# EAGLE design Simon (EAGLE 8.7.1)
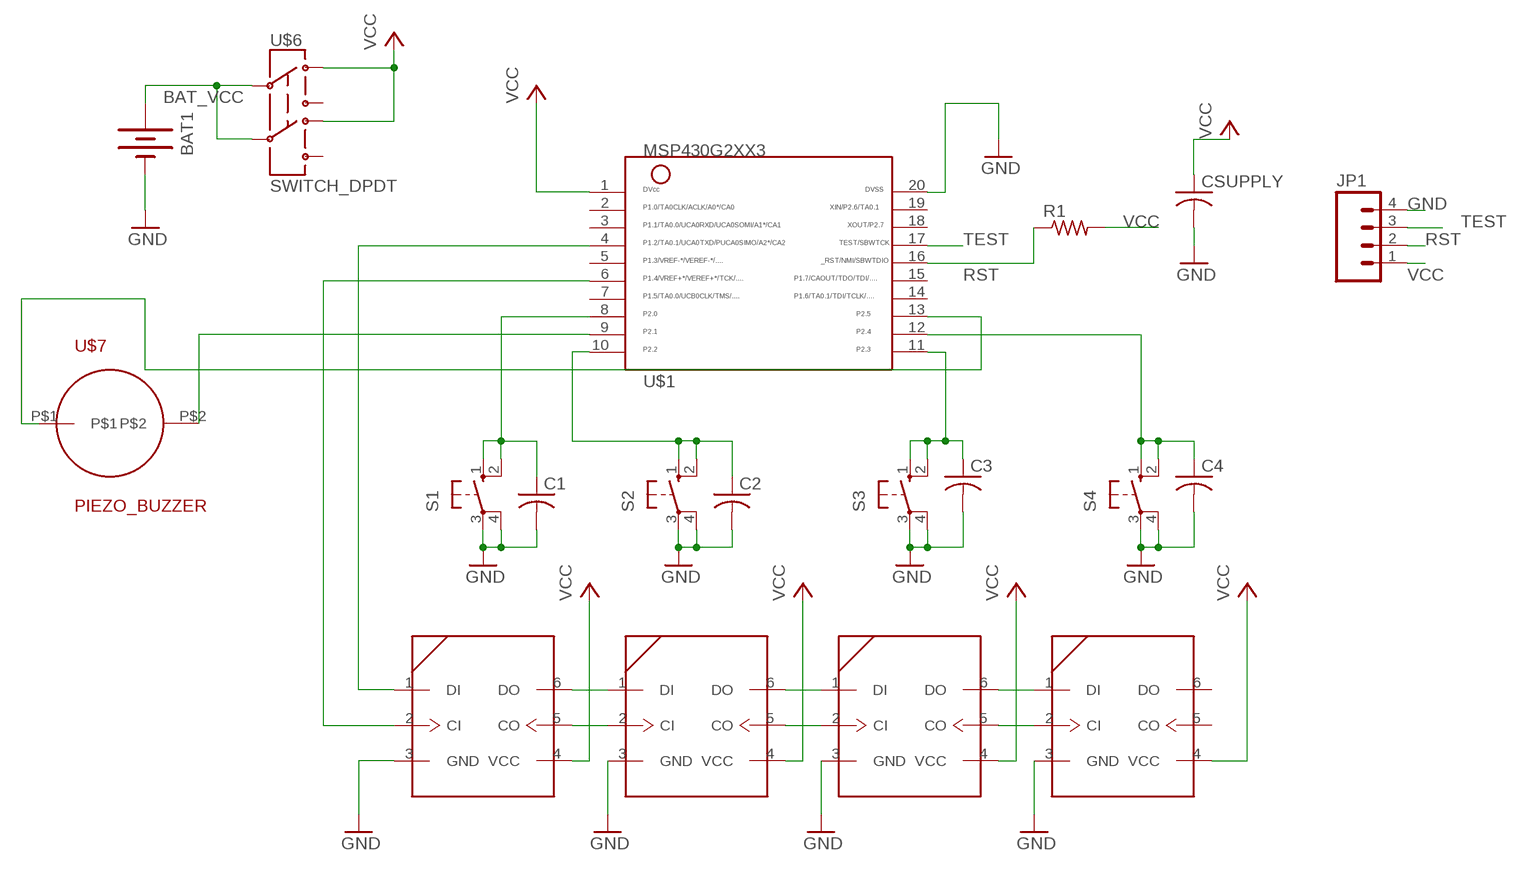
[diagram p0: schematic, sheet 1]

## Parts
BAT1  BATTERY  [BATTERY_PACK_2AA]
C1  C-USC1206  [C1206]
C2  C-USC1206  [C1206]
C3  C-USC1206  [C1206]
C4  C-USC1206  [C1206]
CSUPPLY  C-USC1206  [C1206]
JP1  M04LOCK  [1X04_LOCK]
LED1  APA102  [5050]
LED2  APA102  [5050]
LED3  APA102  [5050]
LED4  APA102  [5050]
R1  R-US_R1206  [R1206]
S1  10-XX  [B3F-10XX]
S2  10-XX  [B3F-10XX]
S3  10-XX  [B3F-10XX]
S4  10-XX  [B3F-10XX]
U$1  MSP430G2XX3TSSOP  [PW20]
U$6  SWITCH_DPDT  [JS_DPDT_TH]
U$7  PIEZO_BUZZER  [PIEZO_BUZZER]

## Nets
BAT_VCC: BAT1.3V(+) U$6.2 U$6.5
GND: BAT1.GND(-) C1.2 C2.2 C3.2 C4.2 CSUPPLY.2 JP1.4 LED1.3(GND) LED2.3(GND) LED3.3(GND) LED4.3(GND) S1.3(P) S1.4(P1) S2.3(P) S2.4(P1) S3.3(P) S3.4(P1) S4.3(P) S4.4(P1) U$1.20
N$1: LED1.6(DO) LED2.1(DI)
N$2: LED1.5(CO) LED2.2(CI)
N$3: LED2.6(DO) LED3.1(DI)
N$4: LED2.5(CO) LED3.2(CI)
N$5: LED3.6(DO) LED4.1(DI)
N$6: LED3.5(CO) LED4.2(CI)
N$7: LED1.1(DI) U$1.4
N$8: LED1.2(CI) U$1.6
N$10: U$1.9 U$7.P$2
N$11: U$1.13 U$7.P$1
N$13: C1.1 S1.1(S) S1.2(S1) U$1.8
N$14: C2.1 S2.1(S) S2.2(S1) U$1.10
N$15: C3.1 S3.1(S) S3.2(S1) U$1.11
N$16: C4.1 S4.1(S) S4.2(S1) U$1.12
RST: JP1.2 R1.1 U$1.16
TEST: JP1.3 U$1.17
VCC: CSUPPLY.1 JP1.1 LED1.4(VCC) LED2.4(VCC) LED3.4(VCC) LED4.4(VCC) R1.2 U$1.1 U$6.1 U$6.4
Unconnected: LED4.5(CO) LED4.6(DO) U$1.2 U$1.3 U$1.5 U$1.7 U$1.14 U$1.15 U$1.18 U$1.19 U$6.3 U$6.6

## Library data of the parts
BAT1 = ELEC327:BATTERY: Battery Holders Various common sizes : AA, AAA, 20mm coin cell and 12mm coin cell. 20MM_4LEGS, BATT-10373
C1-C4 CSUPPLY = rcl:C-US: CAPACITOR, American symbol
JP1 = SparkFun:M04: Header 4 Standard 4-pin 0.1" header. Use with straight break away headers (SKU : PRT-00116), right angle break away headers (PRT-00553), swiss pins (PRT-00743), machine pins (PRT-00117), and female headers (PRT-00115). Molex polarized connector foot print use with SKU : PRT-08231 with associated crimp pins and housings. 1MM SMD Version SKU: PRT-10208
LED1-LED4 = ELEC327:APA102: APA102 SPI RGB LED APA102 is a chainable RGB LED. The control protocol is a variant of SPI.
R1 = resistor:R-US_: RESISTOR, American symbol
S1-S4 = switch-omron:10-XX: OMRON SWITCH; MPN: B3F-1000; OC_FARNELL: 176432; OC_NEWARK: 36M3542
U$1 = ELEC327:MSP430G2XX3: MSP430G2XX3 PDIP (N) 20 Pin Package
U$6 = ELEC327:SWITCH_DPDT
U$7 = ELEC327:PIEZO_BUZZER

## Board
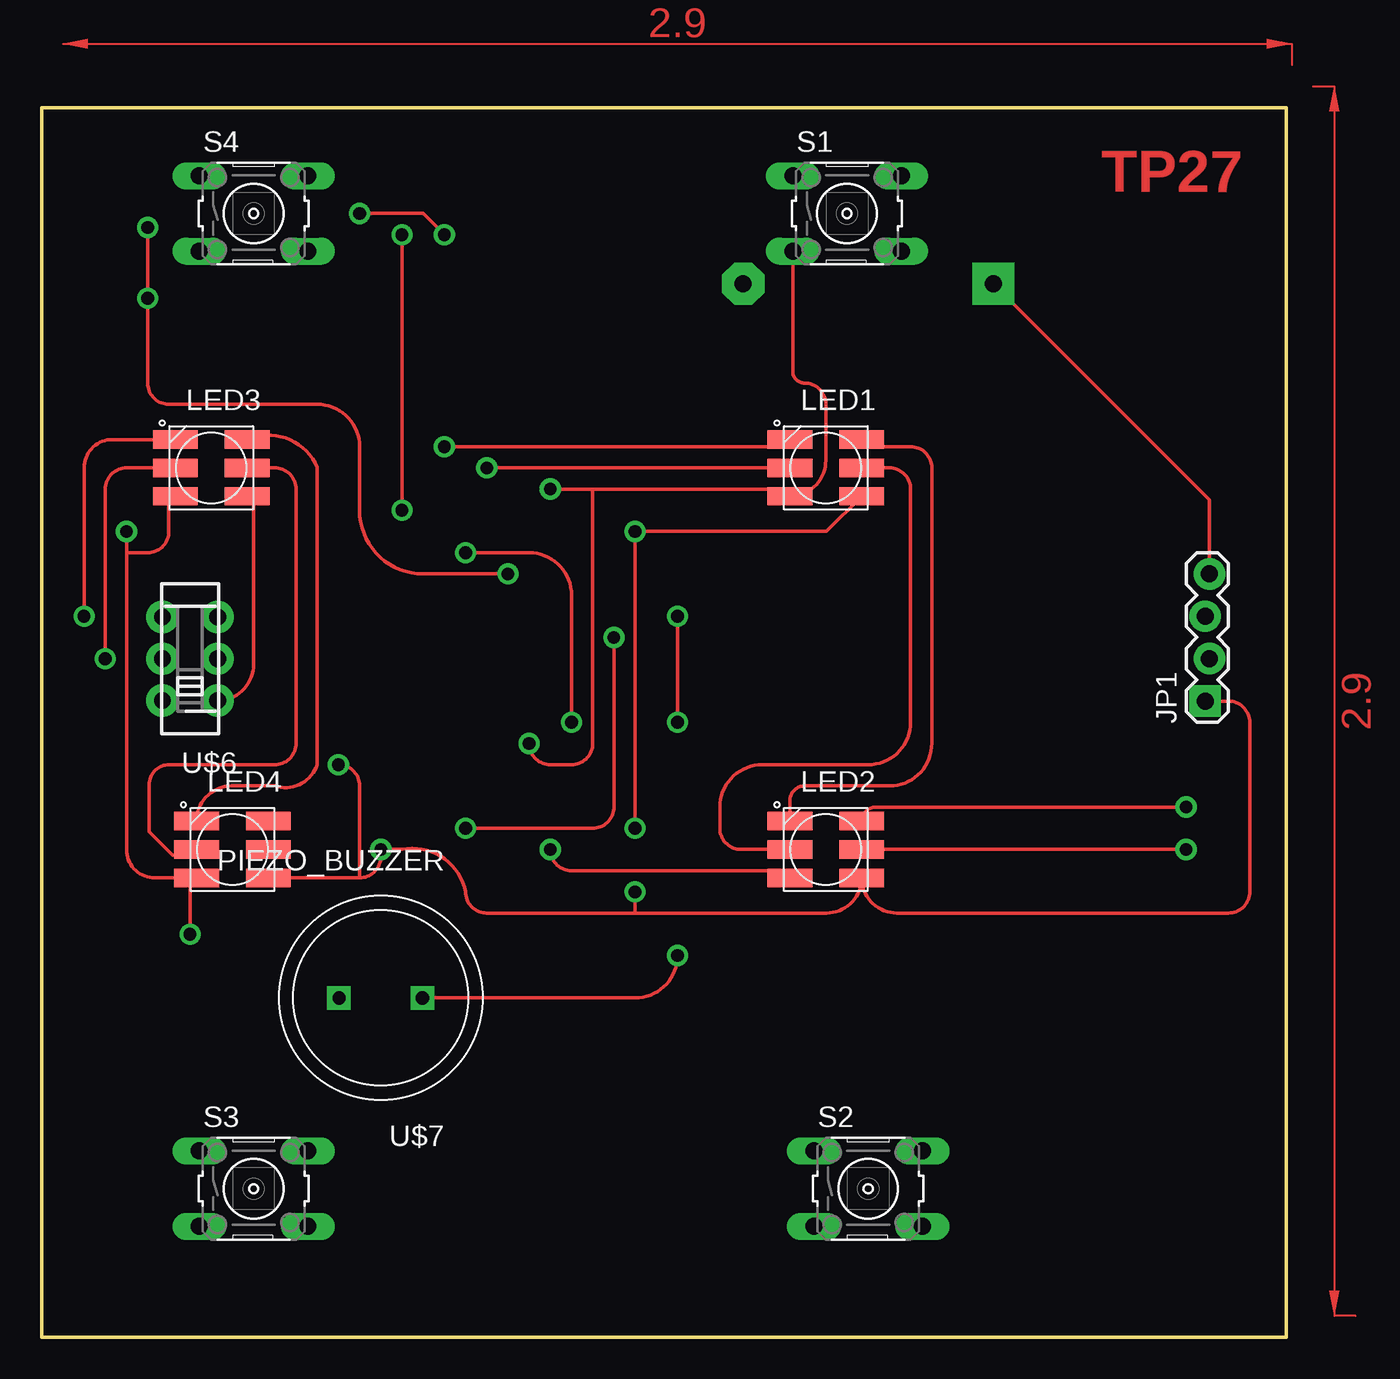
[diagram p1: board, top side]
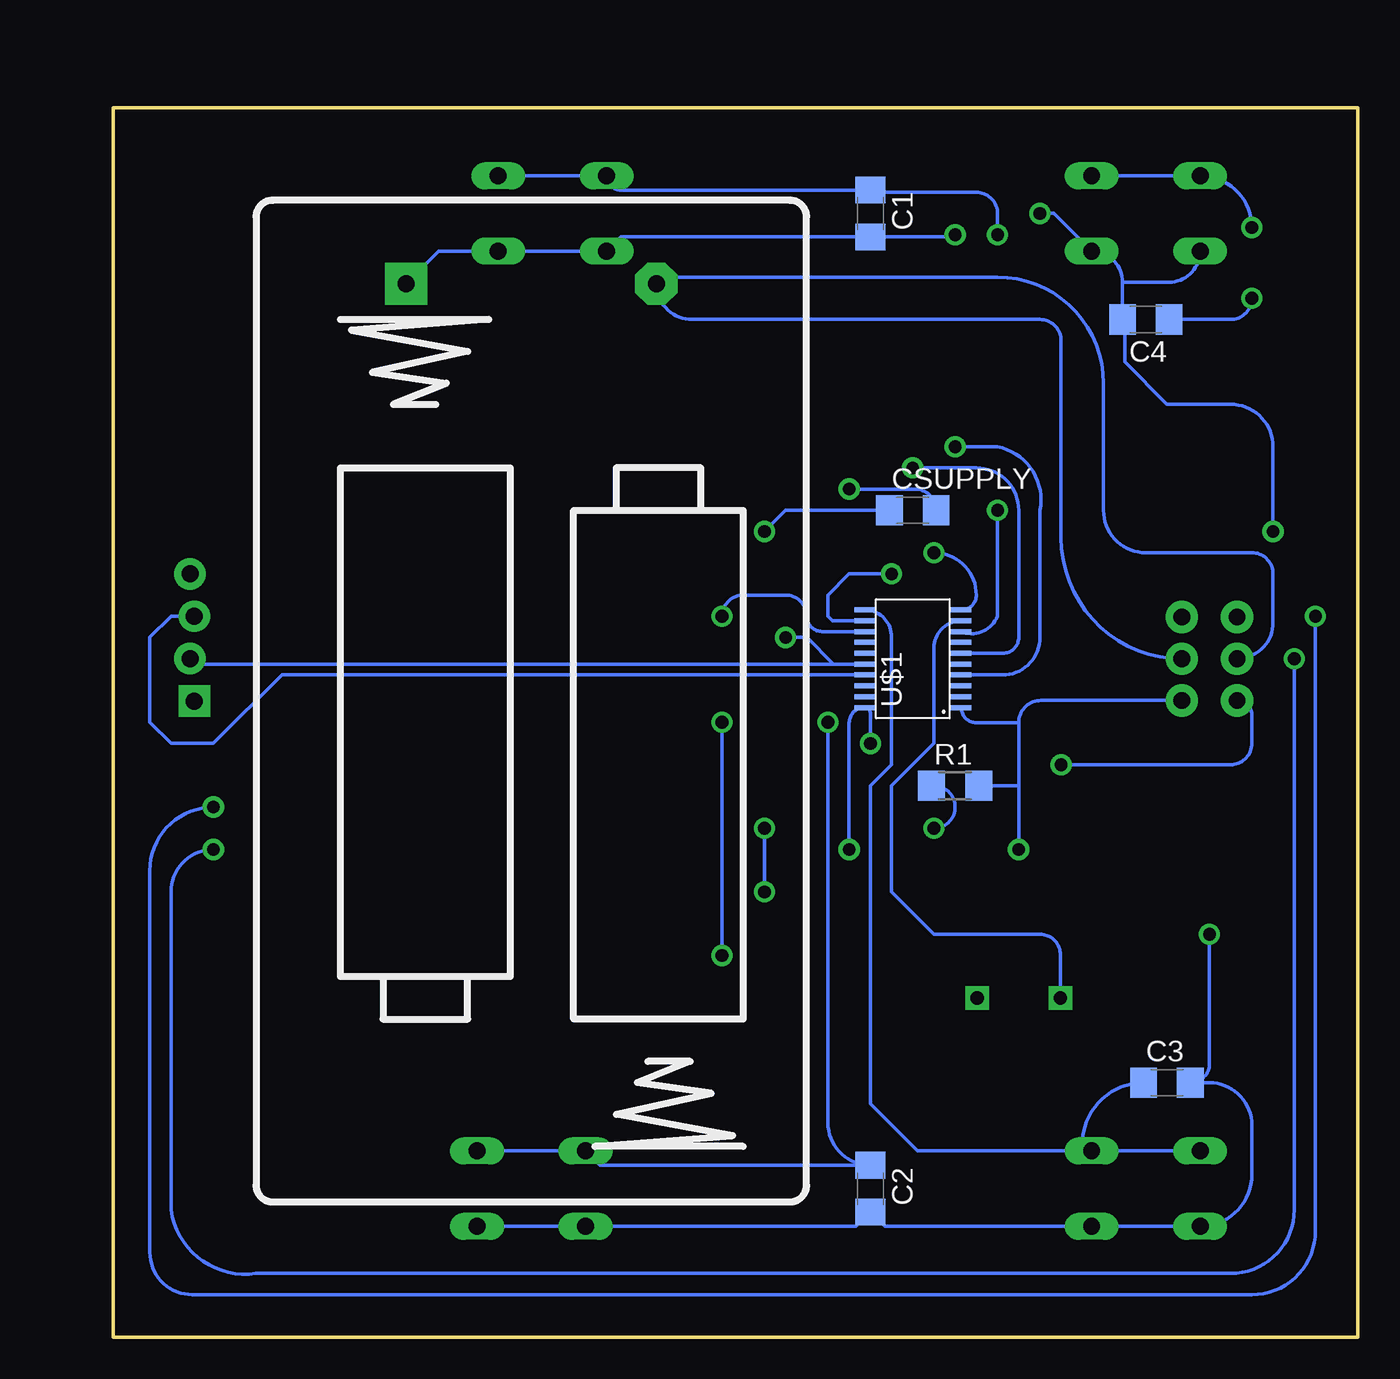
[diagram p2: board, bottom side, seen from below]

Size 74.6 x 73.65 mm. Coordinates in mm from the lower left corner, seen from the top.
Outline: 0,0 74.6,0 74.6,73.65 0,73.65 0,0
Copper layers (1*16): Top 0.035mm / dielectric 1.5mm / Bottom 0.035mm
Design rules "AdvancedCircuitsBarebones": minimum track width 6mil, minimum drill 20mil, track to track 6mil, track to pad 6mil, pad to pad 6mil, via to via 6mil, smd to smd 6mil, copper to edge 10mil, drill to drill 6mil, minimum pad ring 12mil, minimum via ring 10mil, stop-mask expansion 4mil, vias tented up to drill 25mil, thermal gap 10mil

### Footprints (pad centres in the part's own frame; a part is rotated, then mirrored left to right if it is on the bottom)
BATTERY_PACK_2AA = drill 1 pad 2.54 octagon: 3V 7.5,25 | drill 1 pad 2.54 square: GND -7.5,25
C1206 = smd 1.6 x 1.8: 1 -1.4,0; 2 1.4,0
1X04_LOCK = drill 1.016 pad 1.88 square: 1 0,0.127 | drill 1.016 pad 1.88: 2 2.54,-0.127; 3 5.08,0.127; 4 7.62,-0.127
5050 = smd 2.68 x 1.1: 1 -2.15,1.7; 2 -2.15,0; 3 -2.15,-1.7; 4 2.15,-1.7; 5 2.15,0; 6 2.15,1.7
R1206 = smd 1.6 x 1.803: 1 -1.422,0; 2 1.422,0
B3F-10XX = drill 1.016 long: 1 -3.251,2.261; 2 3.251,2.261; 3 -3.251,-2.261; 4 3.251,-2.261
PW20 = smd 0.3 x 1.2: 1 -2.925,-2.9; 2 -2.275,-2.9; 3 -1.625,-2.9; 4 -0.975,-2.9; 5 -0.325,-2.9; 6 0.325,-2.9; 7 0.975,-2.9; 8 1.625,-2.9; 9 2.275,-2.9; 10 2.925,-2.9; 11 2.925,2.9; 12 2.275,2.9; 13 1.625,2.9; 14 0.975,2.9; 15 0.325,2.9; 16 -0.325,2.9; 17 -0.975,2.9; 18 -1.625,2.9; 19 -2.275,2.9; 20 -2.925,2.9
JS_DPDT_TH = drill 1 pad 1.93: 1 -2.5,-1.65; 2 0,-1.65; 3 2.5,-1.65; 4 -2.5,1.65; 5 0,1.65; 6 2.5,1.65
PIEZO_BUZZER = drill 0.8 square: P$1 -2.5,0; P$2 2.5,0

### Placement (x,y rotation side)
BAT1  49.53,38.1 0 bottom
C1  29.21,67.31 270 bottom
C2  29.21,8.89 270 bottom
C3  11.43,15.24 0 bottom
C4  12.7,60.96 180 bottom
CSUPPLY  26.67,49.53 0 bottom
JP1  69.85,38.1 90 top
LED1  46.99,52.07 0 top
LED2  46.99,29.21 0 top
LED3  10.16,52.07 0 top
LED4  11.43,29.21 0 top
R1  24.13,33.02 0 bottom
S1  48.26,67.31 0 top
S2  49.53,8.89 0 top
S3  12.7,8.89 0 top
S4  12.7,67.31 0 top
U$1  26.67,40.64 90 bottom
U$6  8.89,40.64 90 top
U$7  20.32,20.32 180 top

### Tracks (layer width: path | path; a pad name or v marks a point on that pad's centre or on a via)
BAT_VCC
  Bottom 0.203: BAT1.3V 41.91,63.1 41.51,63.5 | BAT1.3V arc90 41.63,63.5 21.59,63.5 arc90 15.24,57.15 15.24,49.53 arc-90 12.7,46.99 6.35,46.99 arc90 5.08,45.72 5.08,42.8 arc90 U$6.5 | BAT1.3V arc-90 39.89,60.96 19.05,60.96 arc90 17.78,59.69 17.78,47.88 arc-90 U$6.2
GND  (via drill 0.76)
  Top 0.203: 33.02,50.8 44.41,50.8 arc-90 LED1.3 arc90 46.99,52.52 46.99,55.88 arc90 45.72,57.15 arc-90 45.01,57.86 45.01,60.4 45.01,60.96 S1.3 | 33.02,50.8 v30.48,50.8 | BAT1.GND 69.98,50.15 JP1.4 | LED2.3 arc90 44.41,27.94 31.75,27.94 arc-90 v30.48,29.21 | v5.08,48.26 5.08,46.99 | 5.08,46.99 5.08,29.21 arc90 6.78,27.51 LED4.3 arc90 8.89,27.12 v8.89,24.13 | v19.05,67.31 22.86,67.31 v24.13,66.04 | LED3.3 arc90 7.62,49.98 7.62,48.26 arc-90 6.35,46.99 5.08,46.99 | 33.02,50.8 33.02,35.56 arc-90 31.75,34.29 30.48,34.29 arc-90 v29.21,35.56
  Bottom 0.203: BAT1.GND 55.08,65.05 S1.4 S1.3 44.15,65.91 C1.2 24.26,65.91 v24.13,66.04 | v30.48,29.21 30.48,36.8 arc90 U$1.20 arc90 29.21,37.35 v29.21,35.56 | S2.4 S2.3 30.07,6.63 C2.2 28.35,6.63 S3.4 S3.3 arc-90 6.35,9.73 6.35,12.7 arc-90 8.89,15.24 C3.2 arc-90 8.89,16.38 v8.89,24.13 | 14.1,63.2 arc-90 S4.4 18.21,67.31 v19.05,67.31 | 14.1,63.2 C4.2 13.97,60.83 13.97,58.42 11.43,55.88 7.62,55.88 arc90 5.08,53.34 v5.08,48.26 | S4.3 arc90 11.3,63.2 14.1,63.2 | 25.4,49.53 CSUPPLY.2 arc-90 26.54,50.8 v30.48,50.8
N$1
  Top 0.203: LED1.6 arc90 49.57,53.34 52.07,53.34 arc-90 53.34,52.07 53.34,35.56 arc-90 50.8,33.02 45.72,33.02 arc90 44.84,32.14 LED2.1
N$2
  Top 0.203: LED2.2 41.91,29.21 arc-90 40.64,30.48 40.64,31.75 arc-90 43.18,34.29 49.53,34.29 arc90 52.07,36.83 52.07,50.8 arc90 50.8,52.07 LED1.5
N$3  (via drill 0.76)
  Top 0.203: LED2.6 arc-90 49.98,31.75 v68.58,31.75 | v2.54,43.18 2.54,52.07 arc-90 4.24,53.77 LED3.1
  Bottom 0.203: v68.58,31.75 arc-90 72.39,27.94 72.39,5.08 arc-90 69.85,2.54 6.35,2.54 arc-90 2.54,6.35 v2.54,43.18
N$4  (via drill 0.76)
  Top 0.203: LED2.5 v68.58,29.21 | 7.62,52.07 LED3.2 5.08,52.07 arc90 3.81,50.8 v3.81,40.64
  Bottom 0.203: v68.58,29.21 arc-90 71.12,26.67 71.12,7.62 arc-90 66.04,3.81 7.62,3.81 arc-90 3.81,7.62 v3.81,40.64
N$5
  Top 0.203: LED3.6 arc-90 16.51,52.11 16.51,34.29 arc-90 13.97,33.02 11.39,33.02 arc90 LED4.1
N$6
  Top 0.203: LED4.2 8.36,28.86 7.85,28.86 6.44,30.27 6.44,33.11 arc-90 7.62,34.29 13.97,34.29 arc90 15.24,35.56 15.24,50.8 arc90 13.97,52.07 LED3.5
N$7  (via drill 0.76)
  Top 0.203: LED1.1 arc-90 44.41,53.34 v24.13,53.34
  Bottom 0.203: v24.13,53.34 21.59,53.34 arc90 19.05,49.53 19.05,41.91 arc90 21.3,39.66 U$1.4
N$8  (via drill 0.76)
  Top 0.203: LED1.2 v26.67,52.07
  Bottom 0.203: v26.67,52.07 22.86,52.07 arc90 20.32,49.53 20.32,41.91 arc90 21.27,40.96 U$1.6
N$10
  Bottom 0.203: U$1.9 arc-90 25.4,41.28 25.4,35.56 27.94,33.02 27.94,26.67 25.4,24.13 19.05,24.13 arc90 17.82,22.9 U$7.P$2
N$11  (via drill 0.76)
  Top 0.203: v38.1,36.83 v38.1,43.18 | v38.1,22.86 arc-90 35.56,20.32 U$7.P$1
  Bottom 0.203: v38.1,22.86 v38.1,36.83 | v38.1,43.18 arc90 36.83,44.45 34.29,44.45 arc90 33.02,43.18 arc-90 32.1,42.27 U$1.13
N$13  (via drill 0.76)
  Top 0.203: v21.59,66.04 v21.59,49.53
  Bottom 0.203: S1.2 S1.1 arc-90 44.15,68.71 C1.1 | C1.1 29.21,68.58 | v21.59,49.53 21.59,43.17 arc90 U$1.8 | v21.59,66.04 21.59,67.31 arc-90 22.86,68.58 29.08,68.58 arc90 C1.1
N$14  (via drill 0.76)
  Top 0.203: v31.75,36.83 31.75,44.45 arc90 29.21,46.99 v25.4,46.99
  Bottom 0.203: S2.2 S2.1 45.42,10.29 C2.1 arc90 31.75,12.83 v31.75,36.83 | v25.4,46.99 arc90 22.86,44.45 arc90 23.74,43.56 U$1.10
N$15
  Bottom 0.203: U$1.11 arc90 27.94,41.93 27.94,34.29 29.21,33.02 29.21,13.97 26.39,11.15 16.51,11.15 | 16.51,11.15 S3.2 S3.1 9.88,11.15 | 16.51,11.15 16.51,11.56 arc90 C3.1 arc90 12.7,15.11
N$16  (via drill 0.76)
  Top 0.203: v6.35,66.47 v6.35,62.23 6.35,57.15 arc90 7.62,55.88 16.51,55.88 arc-90 19.05,53.34 19.05,49.53 arc90 22.86,45.72 v27.94,45.72
  Bottom 0.203: v6.35,66.47 arc-90 S4.1 S4.2 | v6.35,62.23 arc90 7.62,60.96 C4.1 | v27.94,45.72 30.48,45.72 31.75,44.45 31.75,43.18 31.48,42.91 U$1.12
RST  (via drill 0.76)
  Top 0.203: v25.4,30.48 33.02,30.48 arc90 34.29,31.75 v34.29,41.91
  Bottom 0.203: v34.29,41.91 33.02,41.91 31.42,40.31 | 31.42,40.31 U$1.16 | 31.42,40.31 69.65,40.31 arc90 JP1.2 | R1.1 25.4,33.02 arc90 24.13,31.75 arc90 v25.4,30.48
TEST
  Bottom 0.203: U$1.17 64.48,39.66 68.58,35.56 71.12,35.56 72.39,36.83 72.39,41.91 71.12,43.18 JP1.3
VCC  (via drill 0.76)
  Top 0.203: JP1.1 71.12,38.1 arc-90 72.39,36.83 72.39,26.67 arc-90 71.12,25.4 51.25,25.4 arc-90 LED2.4 arc-90 47.03,25.4 35.56,25.4 | LED4.4 19.05,27.51 | v17.78,34.29 arc-90 19.05,33.02 19.05,27.51 | LED3.4 arc-90 12.7,49.98 12.7,40.3 arc-90 U$6.1 | 19.05,27.51 arc90 20.32,28.78 v20.32,29.21 21.59,29.21 arc-90 25.4,26.67 arc90 26.67,25.4 35.56,25.4 | LED1.4 47.03,48.26 v35.56,48.26 v35.56,30.48 | v35.56,26.67 35.56,25.4
  Bottom 0.203: v20.32,29.21 20.32,33.02 | 20.32,33.02 20.32,36.8 | U$6.1 18.98,38.14 arc-90 20.32,36.8 | U$6.4 arc90 6.35,37.25 6.35,35.56 arc90 7.62,34.29 v17.78,34.29 | 20.32,36.8 22.86,36.8 arc90 U$1.1 | 20.32,33.02 R1.2 | CSUPPLY.1 34.29,49.53 v35.56,48.26 | v35.56,30.48 v35.56,26.67
(copper drawn outside any net)
  shapes: Top area x2

### Text on the board
Top: TP27